# Altium schematic sheet WALL_POWER.SchDoc
size Letter; SheetNumber: 6; SheetTotal: 15; SPICEModelCacheTADBTSLA: <root> / <DocumentId>TADBTSLA</DocumentId> / </root>
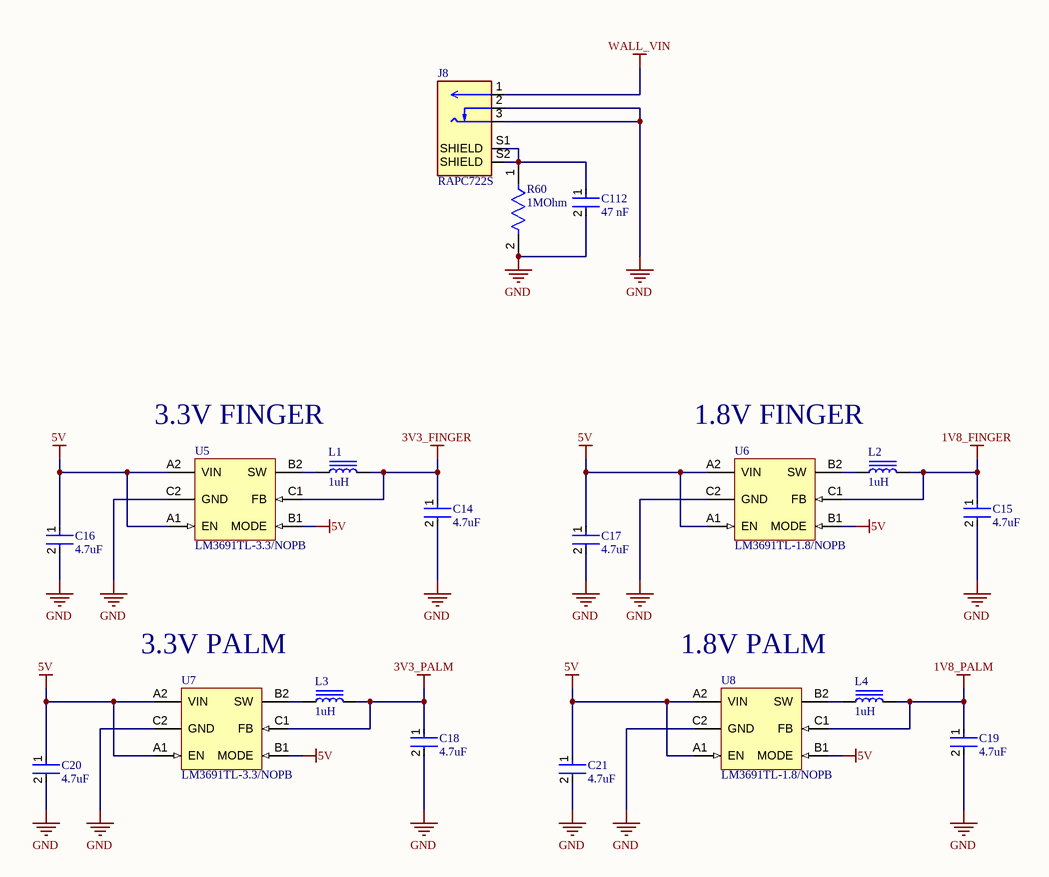
[diagram p0: WALL_POWER.SchDoc]

## Parts
C14  4.7uF  [FP-CL828-IPC_C]
C15  4.7uF  [FP-CL828-IPC_C]
C16  4.7uF  [FP-CL828-IPC_C]
C17  4.7uF  [FP-CL828-IPC_C]
C18  4.7uF  [FP-CL828-IPC_C]
C19  4.7uF  [FP-CL828-IPC_C]
C20  4.7uF  [FP-CL828-IPC_C]
C21  4.7uF  [FP-CL828-IPC_C]
C112  47 nF  [FP-CC0402-MFG]
J8  RAPC722S  [SWITCHCRAFT_RAPC722S]
L1  1uH  [IND 0603_1608 RF WW]
L2  1uH  [IND 0603_1608 RF WW]
L3  1uH  [IND 0603_1608 RF WW]
L4  1uH  [IND 0603_1608 RF WW]
R60  1MOhm  [FP-RMCF0402-MFG]
U5  LM3691TL-3.3/NOPB  [YZR0006APAF]
U6  LM3691TL-1.8/NOPB  [YZR0006APAF]
U7  LM3691TL-3.3/NOPB  [YZR0006APAF]
U8  LM3691TL-1.8/NOPB  [YZR0006APAF]

## Nets
1V8_FINGER: C15.1 L2.2 U6.C1(FB)
1V8_PALM: C19.1 L4.2 U8.C1(FB)
3V3_FINGER: C14.1 L1.2 U5.C1(FB)
3V3_PALM: C18.1 L3.2 U7.C1(FB)
5V: C16.1 C17.1 C20.1 C21.1 U5.A1(EN) U5.A2(VIN) U5.B1(MODE) U6.A1(EN) U6.A2(VIN) U6.B1(MODE) U7.A1(EN) U7.A2(VIN) U7.B1(MODE) U8.A1(EN) U8.A2(VIN) U8.B1(MODE)
GND: C14.2 C15.2 C16.2 C17.2 C18.2 C19.2 C20.2 C21.2 C112.2 J8.2(SHUNT) J8.3(TIP) R60.2 U5.C2(GND) U6.C2(GND) U7.C2(GND) U8.C2(GND)
WALL_VIN: J8.1(PIN)
NetC112_1: C112.1 J8.S1(SHIELD) J8.S2(SHIELD) R60.1
NetL1_1: L1.1 U5.B2(SW)
NetL2_1: L2.1 U6.B2(SW)
NetL3_1: L3.1 U7.B2(SW)
NetL4_1: L4.1 U8.B2(SW)

## Notes on the sheet
- 3.3V FINGER
- 1.8V FINGER
- 3.3V PALM
- 1.8V PALM
- Title
- Copyright (c) Meta Platforms, Inc. and affiliates.
  All rights reserved.
  This source code is licensed under the license found in the
  LICENSE file in the root directory of this source tree.
- Sheet
- of

## Library data of the parts
C14-C21 = CMP-13271-001251-1: Cap Ceramic 4.7uF 10V X5R ±10% SMD 0402 +85°C Paper T/R; Height: 0.5mm; Mount: Surface Mount; Case Code (Metric): 1005; Case/Package: 0402; Capacitance: 4.7uF; Packaging: Tape and Reel; Dielectric: X5R; Radiation Hardening: No; Material: Ceramic; Thickness: 0.022inch; Min Operating Temperature: -55°C; Voltage Rating: 10V; Case Code (Imperial): 0402; Width: 0.02inch; Length: 1mm; Max Operating Temperature: 85°C; Lead Free: Lead Free; Tolerance: 10%; Package Quantity: 1; Depth: 0.5mm
C112 = CMP-03422-000813-1: CAP CER 0.047UF 25V X7R 0402; Manufacturer Part Number: CC0402KRX7R8BB473; Manufacturer: YAGEO; Automotive Grade: NA; Temperature Coefficient: 30ppm/°C; Material: Ceramic; Tolerance: 0.1; Temperature: -55°C to +125°C; Category: Cap; Voltage Rating: 25 V; Digikey Description: CAP CER 0.047UF 25V X7R 0402; Device Class L1: Passive Components; Device Class L3: Ceramic Capacitors; Ipc Land Pattern Name: CAPC10050X50; Value: 47 nF; Temperature Characteristic: X7R; Temperature Range High: +125°C; ComponentLink2URL: http://www.yageo.com/documents/recent/UPY-GP_NP0_16V-to-50V_16.pdf; Automotive: No; Temperature Range Low: -55°C; Package: CC0402; RoHS: TRUE; Height: 0.55mm; Device Class L2: Capacitors; Capacitance: 47 nF; Octopart: https://octopart.com/cc0402krx7r8bb473-yageo-22850998; Lead Free: Yes; Mouser Description: Multilayer Ceramic Capacitors MLCC - SMD/SMT 47nF 25V X7R 10%; Footprint Url: http://www.yageo.com/exep/pages/download/literatures/UPY-C_GEN_24.pdf; ComponentLink2Description: Datasheet
J8 = RAPC722S: Power Barrel Connector Jack 2.10mm ID (0.083), 5.50mm OD (0.217) Through Hole, Right Angle; MF: Switchcraft Inc.; Package: None; Digi-Key_Part_Number: SC3723-ND; Purchase-URL: https://pricing.snapeda.com/search/part/RAPC722S/?ref=eda; Value: *; SnapEDA_Link: https://www.snapeda.com/parts/RAPC722S/Switchcraft+%252F+Conxall/view-part/?ref=snap; Check_prices: https://www.snapeda.com/parts/RAPC722S/Switchcraft+%252F+Conxall/view-part/?ref=eda; MP: RAPC722S
L1-L4 = MCHK1608T1R0MKN: SMT Inductor; Manufacturer: Taiyo Yuden; Part Number: MCHK1608T1R0MKN; Value: 1uH
R60 = CMP-2000-06985-2: 1MΩ ±1% 0.063W 0402 Thick Film Chip Resistor AEC-Q200 compliant; Max Power Dissipation: 63mW; Resistance: 1MR; Power Rating: 62.5mW; Temperature Coefficient: 100ppm/°C; Resistor Type: Thick Film; Military Standard: Not; Packaging: Tape and Reel; Radiation Hardening: No; Construction: Rectangular; Length: 1mm; Case/Package: 0402; Width: 0.02inch; Case Code (Imperial): 0402; Lead Free: Lead Free; Number of Terminations: 2; Min Operating Temperature: -55°C; Height: 0.016inch; Tolerance: 1%; Contact Plating: Tin; Case Code (Metric): 1005; Depth: 0.5mm; Features: Automotive AEC-Q200; Max Operating Temperature: 155°C; Size Code: 0402; Mount: Surface Mount; RoHS Compliant: Yes; Series: RMCF
U5 U7 = CMP-0063-01484-2: High Accuracy, Miniature 1A, Step-Down DC-DC Converter for Portable Applications, 6-pin Micro SMD, 250 Reel; Manufacturer: Texas Instruments; PackageTopMarking: XV*I T; PowerWise: N; CompType: MiscPower; High-Reliability: Y; RoHS: Y; PackageDescription: Thin Micro SMD, 6 Bump (Large), 0.5mm Pitch; PinCount: 6; ComponentLink1URL: http://www.ti.com/general/docs/lit/getliterature.tsp?genericPartNumber=LM3691&fileType=pdf; PackageReference: YZR0006APAF; PartNumber: LM3691TL-3.3/NOPB; ComponentLink1Description: Datasheet URL; Code_JEDEC: MO-211-DB
U6 U8 = CMP-0063-00271-3: High Accuracy, Miniature 1A, Step-Down DC-DC Converter for Portable Applications, 6-pin Micro SMD, Pb-Free; Manufacturer: Texas Instruments; PackageTopMarking: XV*I Z; CompType: MiscPower; High-Reliability: Y; PinCount: 6; PartNumber: LM3691TL-1.8/NOPB; PackageDescription: Thin Micro SMD, 6 Bump (Large), 0.5mm Pitch; RoHS: Y; PackageReference: YZR0006APAF; ComponentLink1URL: http://www.ti.com/general/docs/lit/getliterature.tsp?genericPartNumber=LM3691&fileType=pdf; Code_JEDEC: MO-211-DB; ComponentLink1Description: Datasheet URL; PowerWise: Y